# Altium schematic sheet Sheet1.SchDoc
size A4
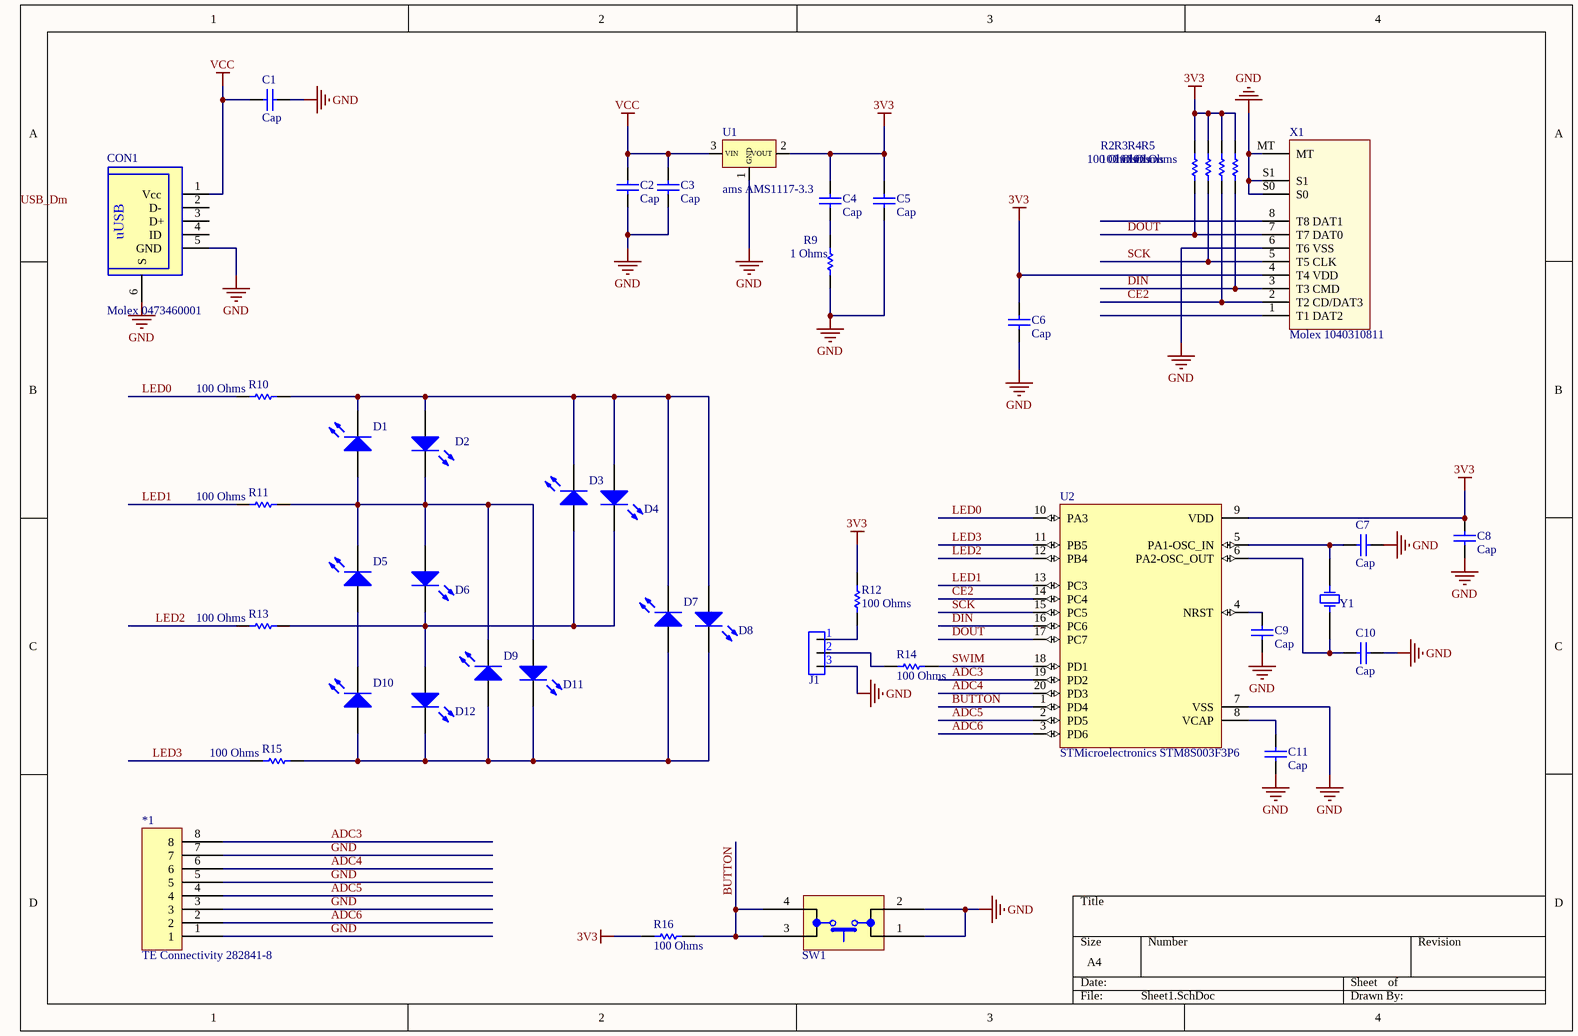
[diagram p0: Sheet1.SchDoc]

## Parts
*1  TE Connectivity 282841-8  [PCB-5n16zmdo33ly3n5be8x4-1]
C1  Cap  [0805_SMD_CAP]
C2  Cap  [0805_SMD_CAP]
C3  Cap  [0805_SMD_CAP]
C4  Cap  [0805_SMD_CAP]
C5  Cap  [0805_SMD_CAP]
C6  Cap  [0805_SMD_CAP]
C7  Cap  [0805_SMD_CAP]
C8  Cap  [0805_SMD_CAP]
C9  Cap  [0805_SMD_CAP]
C10  Cap  [0805_SMD_CAP]
C11  Cap  [0805_SMD_CAP]
CON1  Molex 0473460001  [PCB-2328464-1]
D1  Avago HLMP-1700  [PCB-i0lu3ywj2mjd0tfwcgvk-1]  (value not drawn)
D2  Avago HLMP-1700  [PCB-i0lu3ywj2mjd0tfwcgvk-1]  (value not drawn)
D3  Avago HLMP-1700  [PCB-i0lu3ywj2mjd0tfwcgvk-1]  (value not drawn)
D4  Avago HLMP-1700  [PCB-i0lu3ywj2mjd0tfwcgvk-1]  (value not drawn)
D5  Avago HLMP-1700  [PCB-i0lu3ywj2mjd0tfwcgvk-1]  (value not drawn)
D6  Avago HLMP-1700  [PCB-i0lu3ywj2mjd0tfwcgvk-1]  (value not drawn)
D7  Avago HLMP-1700  [PCB-i0lu3ywj2mjd0tfwcgvk-1]  (value not drawn)
D8  Avago HLMP-1700  [PCB-i0lu3ywj2mjd0tfwcgvk-1]  (value not drawn)
D9  Avago HLMP-1700  [PCB-i0lu3ywj2mjd0tfwcgvk-1]  (value not drawn)
D10  Avago HLMP-1700  [PCB-i0lu3ywj2mjd0tfwcgvk-1]  (value not drawn)
D11  Avago HLMP-1700  [PCB-i0lu3ywj2mjd0tfwcgvk-1]  (value not drawn)
D12  Avago HLMP-1700  [PCB-i0lu3ywj2mjd0tfwcgvk-1]  (value not drawn)
J1  Sensor Temperatura - Final  [PCB-vkgeqjtjqx6hhmcxuagx-1]  (value not drawn)
R2  100 Ohms  [RESC2013X70X40LL20T20]
R3  100 Ohms  [RESC2013X70X40LL20T20]
R4  100 Ohms  [RESC2013X70X40LL20T20]
R5  100 Ohms  [RESC2013X70X40LL20T20]
R9  1 Ohms  [RESC2013X70X40LL20T20]
R10  100 Ohms  [RESC2013X70X40LL20T20]
R11  100 Ohms  [RESC2013X70X40LL20T20]
R12  100 Ohms  [RESC2013X70X40LL20T20]
R13  100 Ohms  [RESC2013X70X40LL20T20]
R14  100 Ohms  [RESC2013X70X40LL20T20]
R15  100 Ohms  [RESC2013X70X40LL20T20]
R16  100 Ohms  [RESC2013X70X40LL20T20]
SW1  TE Connectivity / AMP 1825910-6  [PCB-gaic1pl4705ifv3nefaq-1]  (value not drawn)
U1  ams AMS1117-3.3  [MP04A_N]
U2  STMicroelectronics STM8S003F3P6  [PCB-3782863-1]
X1  Molex 1040310811  [PCB-e07cv7eyfg1wxdj7ioop-1]
Y1  Fox Electronics FOXSLF/080-20  [HC49]  (value not drawn)

## Nets
3V3: C4.1 C5.1 C6.2 C8.2 R2.2 R3.2 R4.2 R5.2 R12.2 R16.2 U1.2(VOUT) U2.9(VDD) X1.4(T4_VDD)
GND: *1.1 *1.3 *1.5 *1.7 C1.1 C2.2 C3.2 C5.2 C6.1 C7.1 C8.1 C9.1 C10.1 C11.1 CON1.5(GND) CON1.6(S) J1.3 R9.1 SW1.1 SW1.2 U1.1(GND) U2.7(VSS) X1.6(T6_VSS) X1.MT X1.S0 X1.S1
VCC: C1.2 C2.1 C3.1 CON1.1(Vcc) U1.3(VIN)
ADC3: *1.8 U2.19(PD2)
ADC4: *1.6 U2.20(PD3)
ADC5: *1.4 U2.2(PD5)
ADC6: *1.2 U2.3(PD6)
BUTTON: R16.1 SW1.3 SW1.4 U2.1(PD4)
CE2: R4.1 U2.14(PC4) X1.2(T2_CD/DAT3)
DIN: R5.1 U2.16(PC6) X1.3(T3_CMD)
DOUT: R2.1 U2.17(PC7) X1.7(T7_DAT0)
LED0: R10.1 U2.10(PA3)
LED1: R11.1 U2.13(PC3)
LED2: R13.1 U2.12(PB4)
LED3: R15.1 U2.11(PB5)
SCK: R3.1 U2.15(PC5) X1.5(T5_CLK)
SWIM: R14.1 U2.18(PD1)
NetC4_2: C4.2 R9.2
NetC7_2: C7.2 U2.5(PA1-OSC_IN) Y1.2
NetC9_2: C9.2 U2.4(NRST)
NetC10_2: C10.2 U2.6(PA2-OSC_OUT) Y1.1
NetC11_2: C11.2 U2.8(VCAP)
NetD1_1: D1.1(A) D2.2(K) D5.2(K) D6.1(A) D9.2(K) D11.1(A) R11.2
NetD1_2: D1.2(K) D2.1(A) D3.2(K) D4.1(A) D7.2(K) D8.1(A) R10.2
NetD3_1: D3.1(A) D4.2(K) D6.2(K) D12.1(A) R13.2
NetD5_1: D5.1(A) D10.2(K)
NetD7_1: D7.1(A) D8.2(K) D9.1(A) D10.1(A) D11.2(K) D12.2(K) R15.2
NetJ1_1: J1.1 R12.1
NetJ1_2: J1.2 R14.2

Not connected (* = marked no-connect by the designer): CON1 2(D-) 3(D+) 4(ID); X1 1(T1_DAT2) 8(T8_DAT1)

## Notes on the sheet
- Labels drawn without touching a wire or pin: USB_Dm
- (in symbol CMP-2328464-2) uUSB

## Library data of the parts
*1 = CMP-0b4dc01c7a6bd48a-1: Buchanan; Conn; Term Blk; PCB; 8; 5.08 mm; 30-12 AWG; Green; 17.5 A; 300 V; Number of Contacts: 8; Pin Pitch: 5.08 mm; Lead-Free Status: Lead Free; ELV Compliant: Compliant; Octopart URL: http://octopart.com/282841-8-te+connectivity-39539776; Manufacturer Part Number: 282841-8; Housing Material: Nylon 6/6; Size-Height: 15.2 mm; Size-Length: 40.6 mm; Size-Width: 9.00 mm; Contact Material: Brass; Mounting Style: Through Hole, Screw; Number of Positions: 8; Housing Color: Green; Number of Rows: 1; Lifecycle Status: Active; Flammability Rating: UL 94 V-0; RoHS: Compliant; Contact Plating: Tin; OctopartID: 0b4dc01c7a6bd48a
C1-C11 = CMP-157020-4: CMS Capacitor; Capacitance Tolerance: ±5%; OctopartID: 154cdccdb346ca8b; Mounting Style: Surface Mount
CON1 = CMP-2328464-2: Conn Micro USB Type B RCP 5 POS 0.65mm Solder RA SMD 5 Terminal 1 Port Embossed T/R; Lifecycle Status: Not Listed by Manufacturer; Octopart Url: https://octopart.com/0473460001-molex-10475099; OctopartID: 7d5eb4cb8e63a299; RoHS: Compliant
D1-D12 = CMP-93ac5aa6a05f4c6b-6: Red 3 mm 50° Tinted Diffused 2 mcd 1.8 V Solid State LED Lamp Through Hole; Forward Voltage: 1.70 V; Lead Length: 26.7 mm; Lead-Free Status: Lead Free; Peak Wavelength: 635 nm; Luminous Intensity: 2.10 mcd; Wavelength: 626 nm; Lens Color: Clear; Packaging: Bulk; Lifecycle Status: Active; OctopartID: 93ac5aa6a05f4c6b; REACH SVHC Compliance: No SVHC; Lens Type: Diffused; Octopart URL: http://octopart.com/hlmp-1700-avago-5781; Manufacturer Part Number: HLMP-1700; Color: Red; Size-Diameter: 3.43 mm; Viewing Angle: 50 °; Number of Pins: 2; RoHS: Compliant; Mounting Style: Through Hole, Vertical
J1 = CMP-740dbf71fd8babca-16: AMPMODU 3 Position 2.54 mm Single Row Through-Hole Straight Breakaway Header; Manufacturer Part Number: 5-146274-3; ELV Compliant: Compliant; Number of Contacts: 3; Gender: Male; Lead-Free Status: Lead Free; Lifecycle Status: Active; Contact Plating: Tin, Tin over Nickel; OctopartID: 740dbf71fd8babca; Octopart URL: http://octopart.com/5-146274-3-te+connectivity+%2F+amp-41331936; Contact Material: Phosphor Bronze; Orientation: Vertical; Flammability Rating: UL 94 V-0; Mounting Style: PCB; RoHS: Compliant; Housing Color: Black
R2-R5 R9-R16 = CMP-3683550-2: Thick Film Resistors - SMD 0805 100Ohms 5% Tolerance; Resistance: 100 Ω; Case/Package: 0805
SW1 = CMP-3ee8f78971b1e12f-10: Switch Tactile OFF (ON) SPST Round Button PC Pins 0.05A 24VDC 100000Cycles 1.57N Thru-Hole Loose; ELV Compliant: Compliant; Lead-Free Status: Lead Free; Contact Plating: Silver; Manufacturer Part Number: 1825910-6; Contact Material: Copper Alloy; Lifecycle Status: Active; Mounting Style: Through Hole; Octopart URL: http://octopart.com/1825910-6-te+connectivity+%2F+amp-7039551; OctopartID: 3ee8f78971b1e12f; RoHS: Compliant
U1 = CMP-3fd1f74ee88ee016-3: Sot223/Pkg 1-Amp 3.3-Volt Low Drop Out Voltage Regulatator; Manufacturer Part Number: AMS1117-3.3; Octopart URL: http://octopart.com/ams1117-3.3-ams-26604089; OctopartID: 3fd1f74ee88ee016
U2 = CMP-3782863-3: IC MCU 8BIT 8KB FLASH 20TSSOP; Clock Speed: 16000000.0 Hz; Lead-Free Status: Lead Free; RAM Memory Size: 1024 B; Lifecycle Status: Active; Number of Pins: 20; Octopart Url: https://octopart.com/stm8s003f3p6-stmicroelectronics-20733190; OctopartID: 7a25b2130245a5e2; REACH SVHC Compliance: No SVHC; RoHS: Compliant
X1 = CMP-a4a36cb6bd117b64-3: 1.10mm Pitch microSD Memory Card Connector, SMT, Push-Pull Type, 1.42mm Height, with Detect Switch; Number of Circuits: 8; Octopart URL: https://octopart.com/1040310811-molex-18824404; Contact Material: Phosphor Bronze; Mounting Style: Surface Mount; Halogen Free Status: Low Halogen; Packaging: Reel; RoHS: Compliant; Manufacturer Part Number: 1040310811; OctopartID: a4a36cb6bd117b64; Contact Plating: Gold; Lifecycle Status: Active; Number of Contacts: 8
Y1 = CMP-783541-2: CRYSTAL 8.0MHZ 20PF THRU; Frequency: 8000000.0 Hz; Lead-Free Status: Lead Free; Load Capacitance: 2e-11 F; Case/Package: HC-49; Mounting Style: Through Hole; Number of Pins: 2; Octopart Url: https://octopart.com/foxslf%2F080-20-fox+electronics-125002; OctopartID: 4077897c8d5b9fb0; Packaging: Bulk; REACH SVHC Compliance: No SVHC; RoHS: Compliant; Size-Height: 0.0036 m; Size-Length: 0.01135 m; Size-Width: 0.00465 m